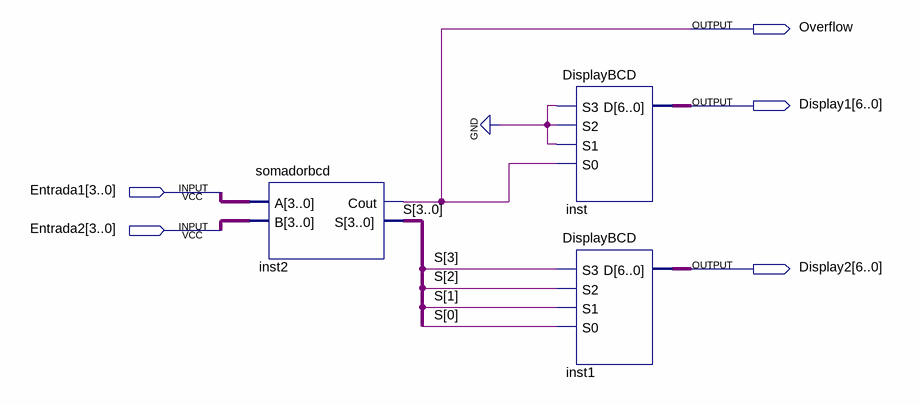
[diagram p0: schematic sheet]
// Quartus schematic SomadorBCDandDisplay.bdf as structural Verilog: 3 symbols, 5 pins
module SomadorBCDandDisplay (
  input  [3:0] Entrada1,
  input  [3:0] Entrada2,
  output Overflow,
  output [6:0] Display1,
  output [6:0] Display2
);

  wire [3:0] S;

  somadorbcd inst2 (.A(Entrada1), .B(Entrada2), .Cout(Overflow), .S(S));
  DisplayBCD inst (.S3(1'b0), .S2(1'b0), .S1(1'b0), .S0(Overflow), .D(Display1));
  DisplayBCD inst1 (.S3(S[3]), .S2(S[2]), .S1(S[1]), .S0(S[0]), .D(Display2));
endmodule
